# EAGLE schematic EMSBoard (EAGLE 9.6.2)
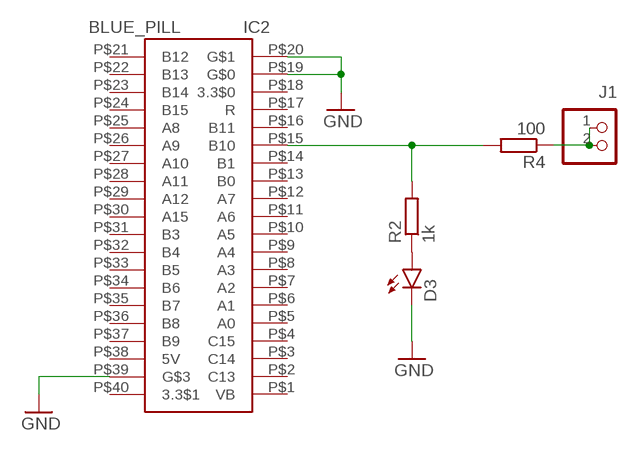
[diagram p0: schematic, sheet 1]

## Parts
D3  LEDCHIP-LED0805  [CHIP-LED0805]
IC2  BLUE_PILL  [BLUE_PILL]
J1  S2B-XH-A  [S2B-XH-A]
R2  1k  R-EU_R0603  [R0603]
R4  100  R-EU_R0603  [R0603]

## Nets
GND: D3.C IC2.P$19(G$0) IC2.P$20(G$1) IC2.P$39(G$3)
N$1: D3.A R2.1
N$2: J1.1 J1.2 R4.1
N$3: IC2.P$15(B10) R2.2 R4.2
Unconnected: IC2.P$1(VB) IC2.P$2(C13) IC2.P$3(C14) IC2.P$4(C15) IC2.P$5(A0) IC2.P$6(A1) IC2.P$7(A2) IC2.P$8(A3) IC2.P$9(A4) IC2.P$10(A5) IC2.P$11(A6) IC2.P$12(A7) IC2.P$13(B0) IC2.P$14(B1) IC2.P$16(B11) IC2.P$17(R) IC2.P$18(3.3$0) IC2.P$21(B12) IC2.P$22(B13) IC2.P$23(B14) IC2.P$24(B15) IC2.P$25(A8) IC2.P$26(A9) IC2.P$27(A10) IC2.P$28(A11) IC2.P$29(A12) IC2.P$30(A15) IC2.P$31(B3) IC2.P$32(B4) IC2.P$33(B5) IC2.P$34(B6) IC2.P$35(B7) IC2.P$36(B8) IC2.P$37(B9) IC2.P$38(5V) IC2.P$40(3.3$1)

## Library data of the parts
D3 = led:LED: LED OSRAM: - CHIPLED LG R971, LG N971, LY N971, LG Q971, LY Q971, LO R971, LY R971 LH N974, LH R974 LS Q976, LO Q976, LY Q976 LO Q996 - Hyper CHIPLED LW Q18S LB Q993, LB Q99A, LB R99A - SideLED LS A670, LO A670, LY A670, LG A670, LP A670 LB A673, LV A673, LT A673, LW A673 LH A674 LY A675 LS A676, LA A676, LO A676, LY A676, LW A676 LS A679, LY A679, LG A679 - Hyper Micro SIDELED® LS Y876, LA Y876, LO Y876, LY Y876 LT Y87S - SmartLED LW L88C, LW L88S LB L89C, LB L89S, LG L890 LS L89K, LO L89K, LY L89K LS L896, LA L896, LO L896, LY L896 - TOPLED LS T670, LO T670, LY T670, LG T670, LP T670 LSG T670, LSP T670, LSY T670, LOP T670, LYG T670 LG T671, LOG T671, LSG T671 LB T673, LV T673, LT T673, LW T673 LH T674 LS T676, LA T676, LO T676, LY T676, LB T676, LH T676, LSB T676, LW T676 LB T67C, LV T67C, LT T67C, LS T67K, LO T67K, LY T67K, LW E67C LS E67B, LA E67B, LO E67B, LY E67B, LB E67C, LV E67C, LT E67C LW T67C LS T679, LY T679, LG T679 LS T770, LO T770, LY T770, LG T770, LP T770 LB T773, LV T773, LT T773, LW T773 LH T774 LS E675, LA E675, LY E675, LS T675 LS T776, LA T776, LO T776, LY T776, LB T776 LHGB T686 LT T68C, LB T68C - Hyper Mini TOPLED® LB M676 - Mini TOPLED Santana® LG M470 LS M47K, LO M47K, LY M47K Source: http://www.osram.convergy.de LUXEON: - LUMILED® LXK2-PW12-R00, LXK2-PW12-S00, LXK2-PW14-U00, LXK2-PW14-V00 LXK2-PM12-R00, LXK2-PM12-S00, LXK2-PM14-U00 LXK2-PE12-Q00, LXK2-PE12-R00, LXK2-PE12-S00, LXK2-PE14-T00, LXK2-PE14-U00 LXK2-PB12-K00, LXK2-PB12-L00, LXK2-PB12-M00, LXK2-PB14-N00, LXK2-PB14-P00, LXK2-PB14-Q00 LXK2-PR12-L00, LXK2-PR12-M00, LXK2-PR14-Q00, LXK2-PR14-R00 LXK2-PD12-Q00, LXK2-PD12-R00, LXK2-PD12-S00 LXK2-PH12-R00, LXK2-PH12-S00 LXK2-PL12-P00, LXK2-PL12-Q00, LXK2-PL12-R00 Source: www.luxeon.com KINGBRIGHT: KA-3528ASYC Source: www.kingbright.com
IC2 = stm32_mcu:BLUE_PILL
J1 = jst-xh:S2B-XH-A: Wire-to-Board 2.5mm pitch side mount connector Source: http://www.jst-mfg.com/product/pdf/jpn/XH.pdf http://www.jst-mfg.com/product/detail.php?series=277
R2 R4 = rcl:R-EU_: RESISTOR, European symbol; SPICEPREFIX: R